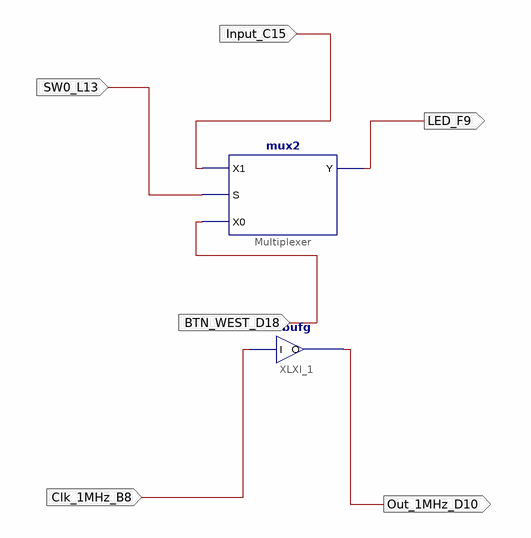
[diagram p0: schematic sheet 1]
// Xilinx ISE schematic board_mux2.sch (spartan3e) as structural Verilog: 2 symbols, 6 ports
module board_mux2 (
  input  Clk_1MHz_B8,
  input  BTN_WEST_D18,
  input  SW0_L13,
  input  Input_C15,
  output LED_F9,
  output Out_1MHz_D10
);

  mux2 Multiplexer (.S(SW0_L13), .X0(BTN_WEST_D18), .X1(Input_C15), .Y(LED_F9));
  bufg XLXI_1 (.I(Clk_1MHz_B8), .O(Out_1MHz_D10));
endmodule
